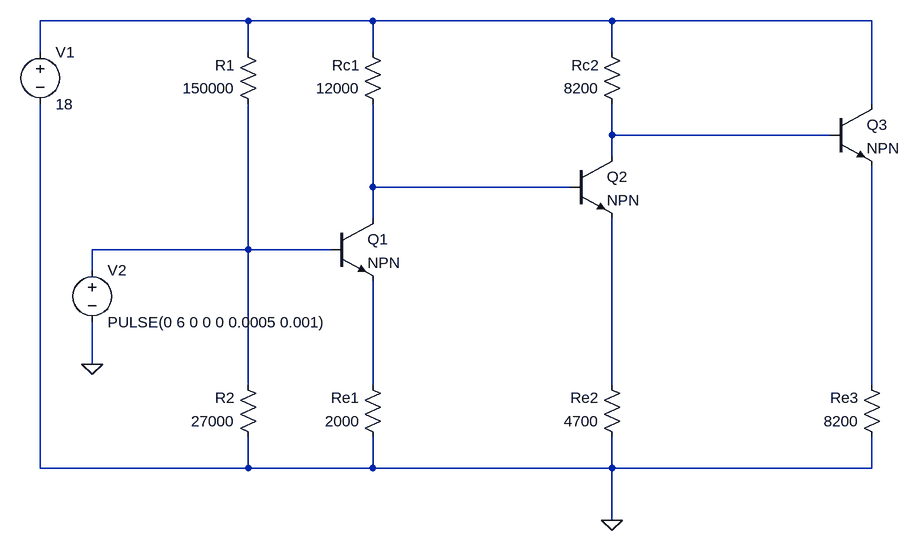
[diagram p0: schematic Multistage_Amplifier.asc]
Multistage_Amplifier.asc, the LTspice schematic file:
Version 4
SHEET 1 956 680
WIRE -48 -192 -368 -192
WIRE 144 -192 -48 -192
WIRE 512 -192 144 -192
WIRE 912 -192 512 -192
WIRE -368 -144 -368 -192
WIRE -48 -144 -48 -192
WIRE 144 -144 144 -192
WIRE 512 -144 512 -192
WIRE 912 -64 912 -192
WIRE 512 -16 512 -64
WIRE 848 -16 512 -16
WIRE 512 16 512 -16
WIRE 144 64 144 -64
WIRE 448 64 144 64
WIRE 144 112 144 64
WIRE -48 160 -48 -64
WIRE -48 160 -288 160
WIRE 80 160 -48 160
WIRE -288 192 -288 160
WIRE -288 336 -288 272
WIRE -48 368 -48 160
WIRE 144 368 144 208
WIRE 512 368 512 112
WIRE 912 368 912 32
WIRE -368 496 -368 -64
WIRE -48 496 -48 448
WIRE -48 496 -368 496
WIRE 144 496 144 448
WIRE 144 496 -48 496
WIRE 512 496 512 448
WIRE 512 496 144 496
WIRE 912 496 912 448
WIRE 912 496 512 496
WIRE 512 576 512 496
FLAG 512 576 0
FLAG -288 336 0
SYMBOL npn 80 112 R0
SYMATTR InstName Q1
SYMBOL npn 448 16 R0
SYMATTR InstName Q2
SYMBOL npn 848 -64 R0
SYMATTR InstName Q3
SYMBOL res -32 -48 R180
WINDOW 0 36 76 Left 2
WINDOW 3 36 40 Left 2
SYMATTR InstName R1
SYMATTR Value 150000
SYMBOL res -32 464 R180
WINDOW 0 36 76 Left 2
WINDOW 3 36 40 Left 2
SYMATTR InstName R2
SYMATTR Value 27000
SYMBOL res 160 -48 R180
WINDOW 0 36 76 Left 2
WINDOW 3 36 40 Left 2
SYMATTR InstName Rc1
SYMATTR Value 12000
SYMBOL res 160 464 R180
WINDOW 0 36 76 Left 2
WINDOW 3 36 40 Left 2
SYMATTR InstName Re1
SYMATTR Value 2000
SYMBOL res 528 464 R180
WINDOW 0 36 76 Left 2
WINDOW 3 36 40 Left 2
SYMATTR InstName Re2
SYMATTR Value 4700
SYMBOL res 528 -48 R180
WINDOW 0 36 76 Left 2
WINDOW 3 36 40 Left 2
SYMATTR InstName Rc2
SYMATTR Value 8200
SYMBOL res 928 464 R180
WINDOW 0 36 76 Left 2
WINDOW 3 36 40 Left 2
SYMATTR InstName Re3
SYMATTR Value 8200
SYMBOL voltage -368 -160 R0
WINDOW 123 0 0 Left 0
WINDOW 39 0 0 Left 0
SYMATTR InstName V1
SYMATTR Value 18
SYMBOL voltage -288 176 R0
WINDOW 123 0 0 Left 0
WINDOW 39 0 0 Left 0
SYMATTR InstName V2
SYMATTR Value PULSE(0 6 0 0 0 0.0005 0.001)

The netlist it stands for:
* Multistage_Amplifier.asc
Q1 N003 N004 N005 0 NPN
Q2 N002 N003 N006 0 NPN
Q3 N001 N002 N007 0 NPN
R1 N004 N001 150000
R2 0 N004 27000
Rc1 N003 N001 12000
Re1 0 N005 2000
Re2 0 N006 4700
Rc2 N002 N001 8200
Re3 0 N007 8200
V1 N001 0 18
V2 N004 0 PULSE(0 6 0 0 0 0.0005 0.001)
.model NPN NPN
.model PNP PNP
.lib standard.bjt
.backanno
.end